# Altium schematic sheet 01_VERSION.SchDoc: MXB-0036-B01
size 485 x 289 mm; ApprovedBy: Jiahui Li; CheckedBy: Jiahui Li; Author: Jiahui Li; CompanyName: Mixosense; DrawnBy: Jiahui Li; Engineer: Jiahui Li; Organization: Mixosense; Revision: B01; SheetNumber: 1; SheetTotal: 2
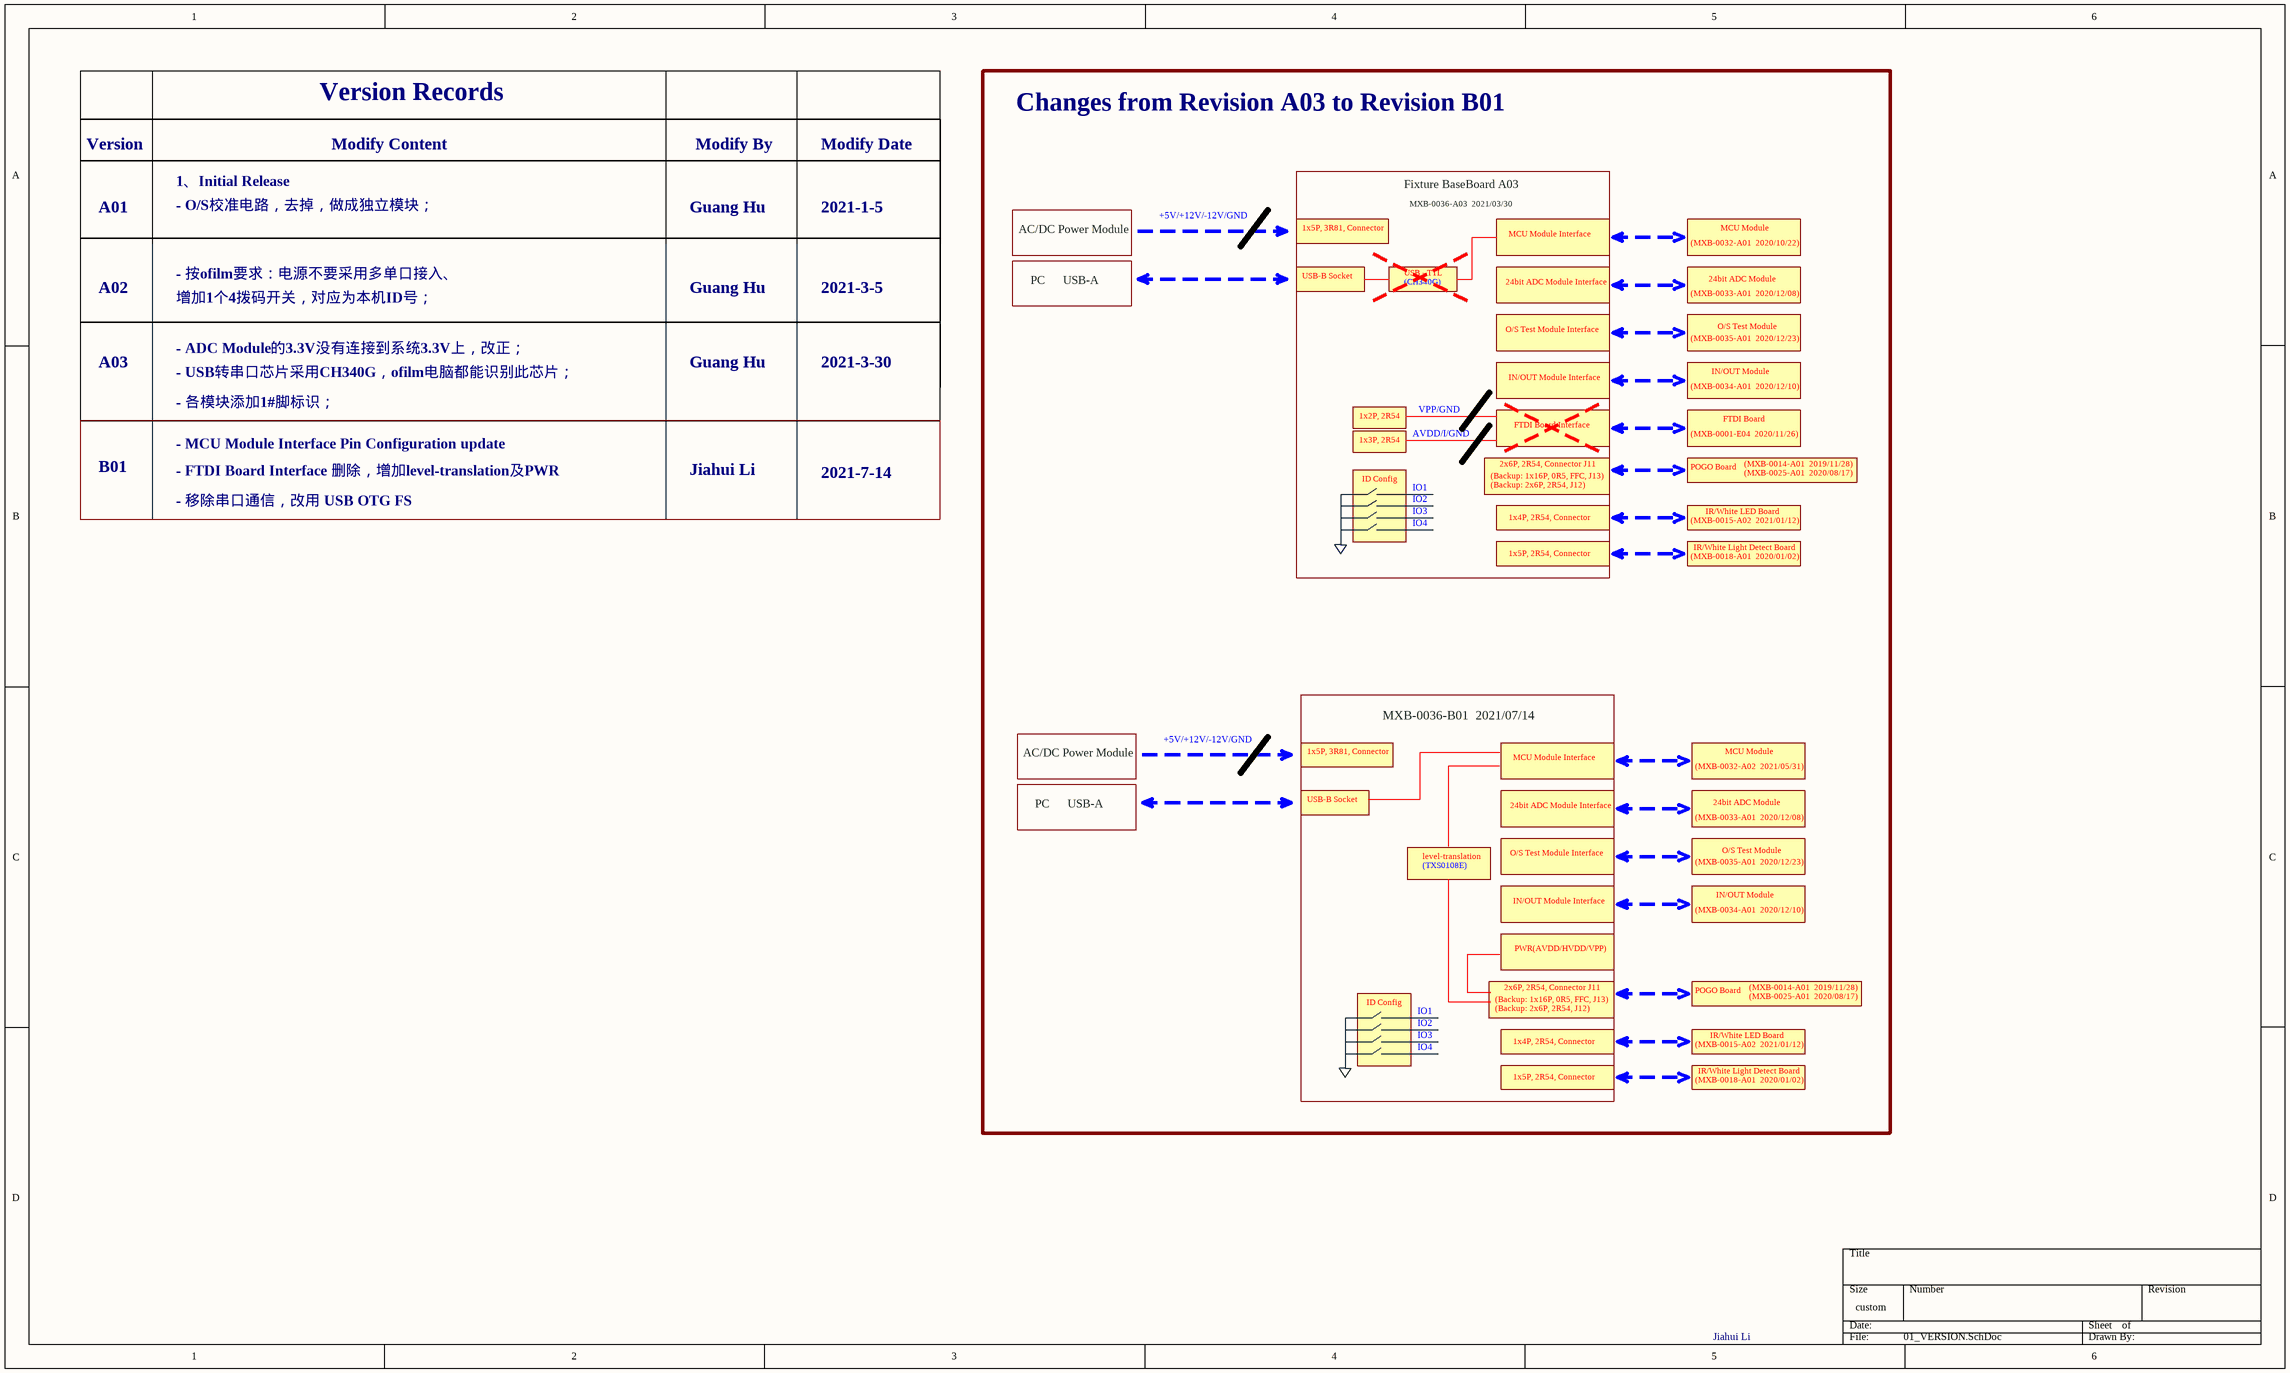
[diagram p0: 01_VERSION.SchDoc]

## Notes on the sheet
- Version Records
- Changes from Revision A03 to Revision B01
- Version
- 1、Initial Release
- Modify Content
- Modify By
- Modify Date
- Fixture BaseBoard A03
- A01
- - O/S校准电路，去掉，做成独立模块；
- Guang Hu
- 2021-1-5
- AC/DC Power Module
- +5V/+12V/-12V/GND
- 1x5P, 3R81, Connector
- MXB-0036-A03  2021/03/30
- MCU Module Interface
- (MXB-0032-A01  2020/10/22)
- MCU Module
- A02
- - 按ofilm要求：电源不要采用多单口接入、
- 增加1个4拨码开关，对应为本机ID号；
- 2021-3-5
- PC      USB-A
- USB-B Socket
- USB - TTL
- (CH340G)
- 24bit ADC Module Interface
- (MXB-0033-A01  2020/12/08)
- 24bit ADC Module
- A03
- - ADC Module的3.3V没有连接到系统3.3V上，改正；
- - USB转串口芯片采用CH340G，ofilm电脑都能识别此芯片；
- 2021-3-30
- O/S Test Module Interface
- (MXB-0035-A01  2020/12/23)
- IN/OUT Module
- O/S Test Module
- - 各模块添加1#脚标识；
- 1x2P, 2R54
- AVDD/I/GND
- VPP/GND
- IN/OUT Module Interface
- FTDI Board Interface
- (MXB-0034-A01  2020/12/10)
- (MXB-0001-E04  2020/11/26)
- FTDI Board
- B01
- - MCU Module Interface Pin Configuration update
- - FTDI Board Interface 删除，增加level-translation及PWR
- Jiahui Li
- 2021-7-14
- 1x3P, 2R54
- ID Config
- IO1
- (Backup: 1x16P, 0R5, FFC, J13)
- (Backup: 2x6P, 2R54, J12)
- 2x6P, 2R54, Connector J11
- POGO Board
- (MXB-0014-A01  2019/11/28)
- (MXB-0025-A01  2020/08/17)
- - 移除串口通信，改用 USB OTG FS
- IO2
- IO3
- IO4
- 1x4P, 2R54, Connector
- 1x5P, 2R54, Connector
- (MXB-0015-A02  2021/01/12)
- IR/White Light Detect Board
- IR/White LED Board
- (MXB-0018-A01  2020/01/02)
- MXB-0036-B01  2021/07/14
- (MXB-0032-A02  2021/05/31)
- level-translation
- (TXS0108E)
- PWR(AVDD/HVDD/VPP)